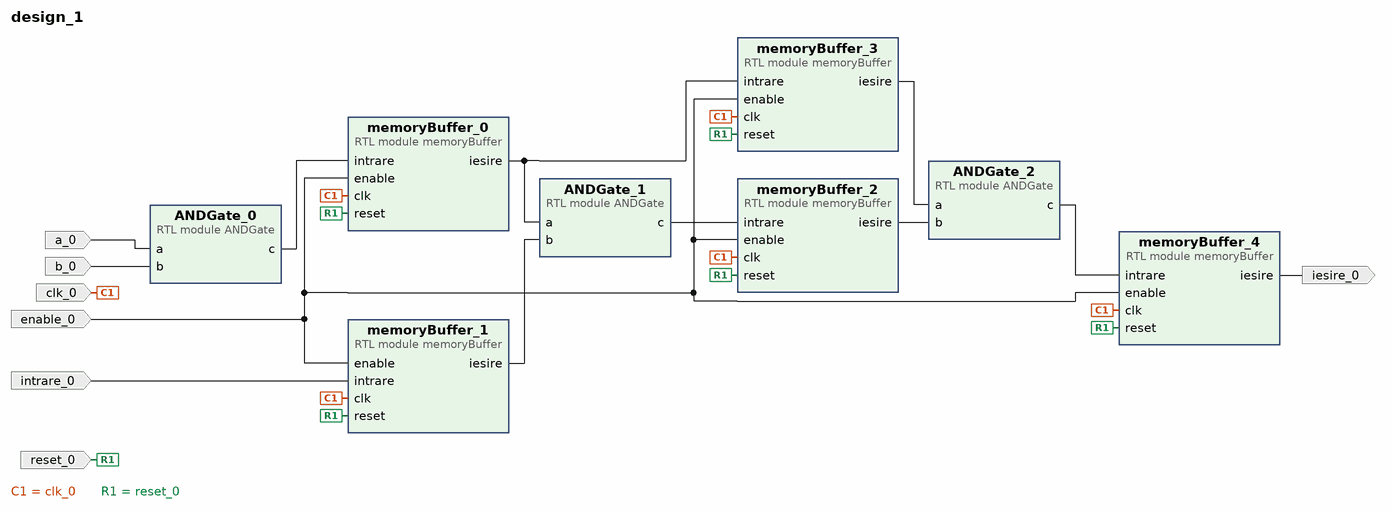
[diagram p0: block diagram of the top level]
# Vivado block design design_1, xc7a100tcsg324-1, Vivado 2020.2
create_bd_design design_1

create_bd_port -dir I intrare_0
create_bd_port -dir I a_0
create_bd_port -dir I b_0
create_bd_port -dir I -type clk clk_0
create_bd_port -dir I -type rst reset_0
create_bd_port -dir I enable_0
create_bd_port -dir O iesire_0

create_bd_cell -type module -reference ANDGate ANDGate_0
create_bd_cell -type module -reference memoryBuffer memoryBuffer_0
create_bd_cell -type module -reference memoryBuffer memoryBuffer_1
create_bd_cell -type module -reference ANDGate ANDGate_1
create_bd_cell -type module -reference memoryBuffer memoryBuffer_2
create_bd_cell -type module -reference memoryBuffer memoryBuffer_3
create_bd_cell -type module -reference ANDGate ANDGate_2
create_bd_cell -type module -reference memoryBuffer memoryBuffer_4

# ---- connections ----

connect_bd_net [get_bd_pins ANDGate_0/c] [get_bd_pins memoryBuffer_0/intrare]
connect_bd_net [get_bd_pins memoryBuffer_0/iesire] [get_bd_pins ANDGate_1/a] [get_bd_pins memoryBuffer_3/intrare]
connect_bd_net [get_bd_pins memoryBuffer_1/iesire] [get_bd_pins ANDGate_1/b]
connect_bd_net -net intrare_0_1 [get_bd_ports intrare_0] [get_bd_pins memoryBuffer_1/intrare]
connect_bd_net -net a_0_1 [get_bd_ports a_0] [get_bd_pins ANDGate_0/a]
connect_bd_net -net b_0_1 [get_bd_ports b_0] [get_bd_pins ANDGate_0/b]
connect_bd_net -net clk_0_1 [get_bd_ports clk_0] \
  [get_bd_pins memoryBuffer_0/clk] [get_bd_pins memoryBuffer_1/clk] [get_bd_pins memoryBuffer_3/clk] \
  [get_bd_pins memoryBuffer_2/clk] [get_bd_pins memoryBuffer_4/clk]
connect_bd_net -net reset_0_1 [get_bd_ports reset_0] \
  [get_bd_pins memoryBuffer_0/reset] [get_bd_pins memoryBuffer_1/reset] [get_bd_pins memoryBuffer_3/reset] \
  [get_bd_pins memoryBuffer_2/reset] [get_bd_pins memoryBuffer_4/reset]
connect_bd_net -net enable_0_1 [get_bd_ports enable_0] \
  [get_bd_pins memoryBuffer_0/enable] [get_bd_pins memoryBuffer_1/enable] [get_bd_pins memoryBuffer_3/enable] \
  [get_bd_pins memoryBuffer_2/enable] [get_bd_pins memoryBuffer_4/enable]
connect_bd_net [get_bd_pins ANDGate_1/c] [get_bd_pins memoryBuffer_2/intrare]
connect_bd_net [get_bd_pins memoryBuffer_3/iesire] [get_bd_pins ANDGate_2/a]
connect_bd_net [get_bd_pins memoryBuffer_2/iesire] [get_bd_pins ANDGate_2/b]
connect_bd_net [get_bd_pins ANDGate_2/c] [get_bd_pins memoryBuffer_4/intrare]
connect_bd_net [get_bd_pins memoryBuffer_4/iesire] [get_bd_ports iesire_0]

validate_bd_design
save_bd_design
